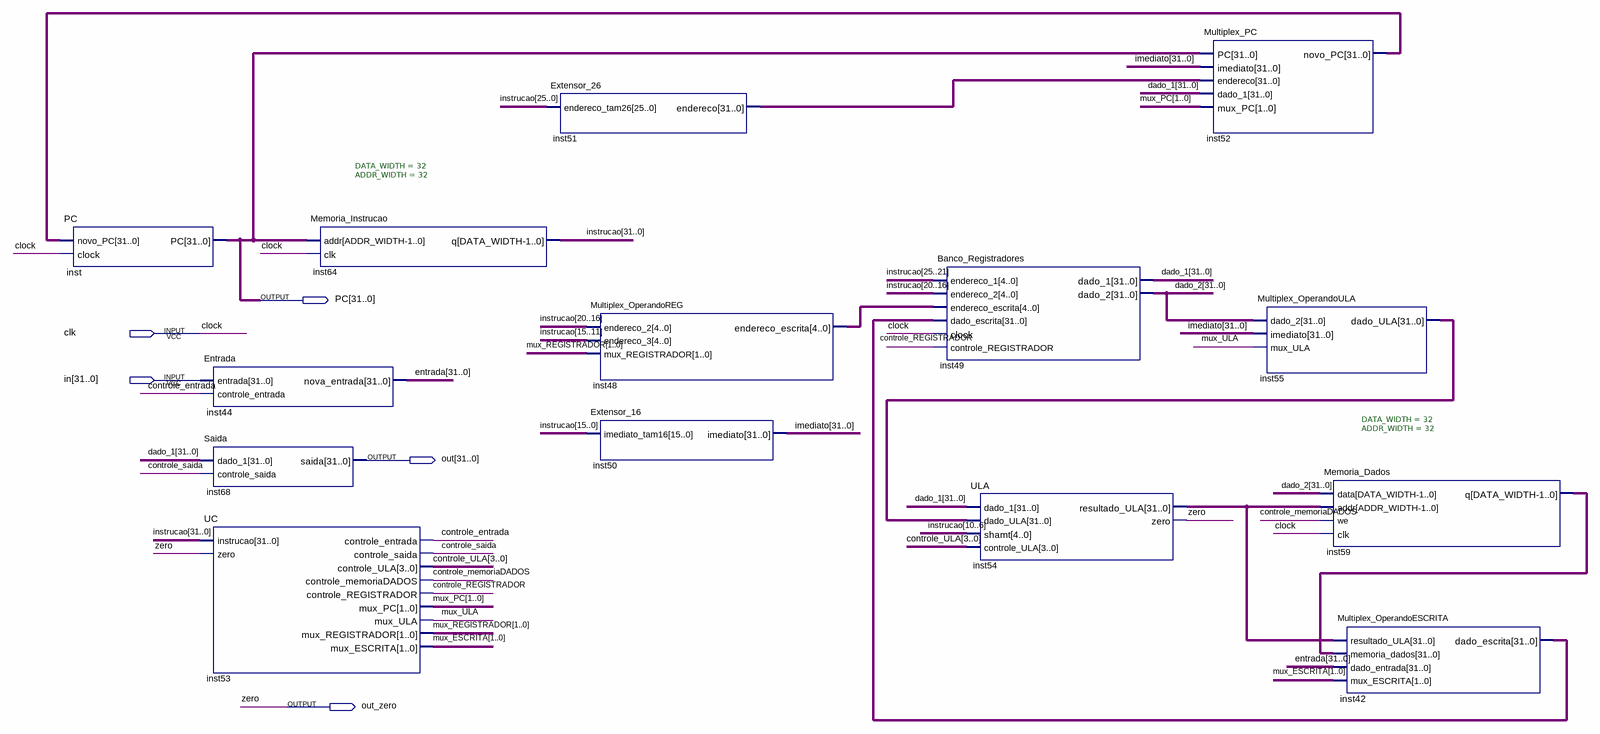
[diagram p0: schematic sheet]
// Quartus schematic Processador_MIPS_Esquematico.bdf as structural Verilog: 14 symbols, 5 pins
module Processador_MIPS_Esquematico (
  input  clk,
  input  [31:0] in,
  output [31:0] PC,
  output [31:0] out,
  output out_zero
);

  wire controle_entrada, controle_memoriaDADOS, controle_REGISTRADOR, controle_saida, mux_ULA;
  wire [1:0] mux_ESCRITA, mux_PC, mux_REGISTRADOR;
  wire [3:0] controle_ULA;
  wire [4:0] inst48_endereco_escrita;
  wire [31:0] dado_1, dado_2, entrada, imediato, inst42_dado_escrita, inst51_endereco, inst52_novo_pc,
       inst54_resultado_ula, inst55_dado_ula, inst59_q, instrucao;

  PC inst (.novo_PC(inst52_novo_pc), .clock(clk), .PC(PC));
  Entrada inst44 (.entrada(in), .controle_entrada(controle_entrada), .nova_entrada(entrada));
  Saida inst68 (.dado_1(dado_1), .controle_saida(controle_saida), .saida(out));
  UC inst53 (
    .instrucao(instrucao), .zero(out_zero), .controle_entrada(controle_entrada),
    .controle_saida(controle_saida), .controle_ULA(controle_ULA),
    .controle_memoriaDADOS(controle_memoriaDADOS), .controle_REGISTRADOR(controle_REGISTRADOR),
    .mux_PC(mux_PC), .mux_ULA(mux_ULA), .mux_REGISTRADOR(mux_REGISTRADOR), .mux_ESCRITA(mux_ESCRITA));
  Memoria_Instrucao #(.DATA_WIDTH(32), .ADDR_WIDTH(32)) inst64 (.addr(PC), .clk(clk), .q(instrucao));
  Extensor_26 inst51 (.endereco_tam26(instrucao[25:0]), .endereco(inst51_endereco));
  Multiplex_OperandoREG inst48 (
    .endereco_2(instrucao[20:16]), .endereco_3(instrucao[15:11]), .mux_REGISTRADOR(mux_REGISTRADOR),
    .endereco_escrita(inst48_endereco_escrita));
  Extensor_16 inst50 (.imediato_tam16(instrucao[15:0]), .imediato(imediato));
  Banco_Registradores inst49 (
    .endereco_1(instrucao[25:21]), .endereco_2(instrucao[20:16]), .endereco_escrita(inst48_endereco_escrita),
    .dado_escrita(inst42_dado_escrita), .clock(clk), .controle_REGISTRADOR(controle_REGISTRADOR),
    .dado_1(dado_1), .dado_2(dado_2));
  ULA inst54 (
    .dado_1(dado_1), .dado_ULA(inst55_dado_ula), .shamt(instrucao[10:6]), .controle_ULA(controle_ULA),
    .resultado_ULA(inst54_resultado_ula), .zero(out_zero));
  Multiplex_PC inst52 (
    .PC(PC), .imediato(imediato), .endereco(inst51_endereco), .dado_1(dado_1), .mux_PC(mux_PC),
    .novo_PC(inst52_novo_pc));
  Multiplex_OperandoULA inst55 (.dado_2(dado_2), .imediato(imediato), .mux_ULA(mux_ULA), .dado_ULA(inst55_dado_ula));
  Memoria_Dados #(.DATA_WIDTH(32), .ADDR_WIDTH(32)) inst59 (
    .data(dado_2), .addr(inst54_resultado_ula), .we(controle_memoriaDADOS), .clk(clk), .q(inst59_q));
  Multiplex_OperandoESCRITA inst42 (
    .resultado_ULA(inst54_resultado_ula), .memoria_dados(inst59_q), .dado_entrada(entrada),
    .mux_ESCRITA(mux_ESCRITA), .dado_escrita(inst42_dado_escrita));

  // Other names for the same wires on the sheet: clock = clk; zero = out_zero
endmodule
